# Altium schematic sheet debug.SchDoc
size A4; Organization: Altium Limited; Address1: L3, 12a Rodborough Rd; Address2: Frenchs Forest; Address3: NSW; Address4: Australia 2086
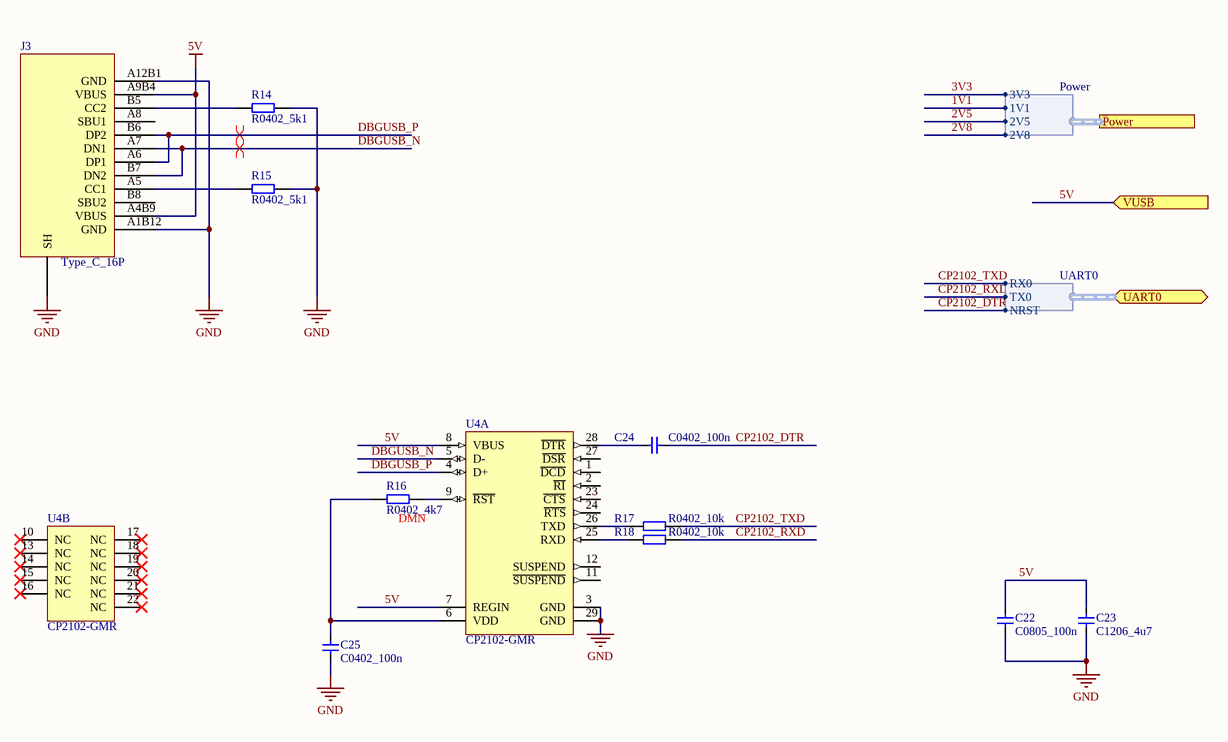
[diagram p0: debug.SchDoc]

## Parts
C22  C0805_100n  [C0805]
C23  C1206_4u7  [C1206]
C24  C0402_100n  [C0402]
C25  C0402_100n  [C0402]
J3  Type_C_16P  [Type_C_16P]
R14  R0402_5k1  [R0402]
R15  R0402_5k1  [R0402]
R16  R0402_4k7  [R0402]
R17  R0402_10k  [R0402]
R18  R0402_10k  [R0402]
U4  CP2102-GMR  [SLAB-QFN-28-3125x3125TP_M]  (parts A,B of 2)

## Ports
Power (harness Power), UART0 (bidir, harness UART0), VUSB (in)

## Harnesses
Power: 3V3, 1V1, 2V5, 2V8
UART0: RX0, TX0, NRST

## Nets
5V: C22.1 C23.1 J3.A4B9(VBUS) J3.A9B4(VBUS) U4.7(REGIN) U4.8(VBUS) ; port VUSB
GND: C22.2 C23.2 C25.2 J3.0(SH) J3.A1B12(GND) J3.A12B1(GND) R14.2 R15.2 U4.3(GND) U4.29(GND)
1V1: port Power.1V1
2V5: port Power.2V5
2V8: port Power.2V8
3V3: port Power.3V3
CP2102_DTR: C24.2 ; port UART0.NRST
CP2102_RXD: R18.2 ; port UART0.TX0
CP2102_TXD: R17.2 ; port UART0.RX0
DBGUSB_N: J3.A7(DN1) J3.B7(DN2) U4.5(D-)
DBGUSB_P: J3.A6(DP1) J3.B6(DP2) U4.4(D+)
NetC24_1: C24.1 U4.28(~{DTR})
NetC25_1: C25.1 R16.1 U4.6(VDD)
NetJ3_A5: J3.A5(CC1) R15.1
NetJ3_B5: J3.B5(CC2) R14.1
NetR16_2: R16.2 U4.9(~{RST})
NetR17_1: R17.1 U4.26(TXD)
NetR18_1: R18.1 U4.25(RXD)

Not connected (* = marked no-connect by the designer): J3 A8(SBU1) B8(SBU2); U4 1(~{DCD}) 2(~{RI}) 10(NC)* 11(~{SUSPEND}) 12(SUSPEND) 13(NC)* 14(NC)* 15(NC)* 16(NC)* 17(NC)* 18(NC)* 19(NC)* 20(NC)* 21(NC)* 22(NC)* 23(~{CTS}) 24(~{RTS}) 27(~{DSR})

## Layout directives
differential pair: DBGUSB_N, DBGUSB_P

## Notes on the sheet
- (near R16) DMN
- Title
- Size:
- Date:
- A4
- Number:
- Time:
- Revision:
- Sheet
- of
- File:

## Library data of the parts
C22 = CMP-003-0073-1: Manufacturer 1: Kemet; Manufacturer Part Number 1: C0805C104K3RAC; Dielectric: X7R; Value: 100n; Tolerance: 0.1%; Voltage Rating DC: 25V; Hidden Value: C104; Component Type: Standard; Part Number: C0805_100n; Pin Count: 2
C23 = CMP-003-0093-1: Manufacturer 1: Kemet; Manufacturer Part Number 1: C1206C475K4RAC; Voltage Rating DC: 16V; Dielectric: X7R; Tolerance: 0.1%; Hidden Value: C475; Value: 4u7; Component Type: Standard; Part Number: C1206_4u7; Pin Count: 2
C24 C25 = CMP-003-0006-1: Manufacturer 1: Kemet; Manufacturer Part Number 1: C0402C104K4RACTU; Dielectric: X7R; Voltage Rating DC: 16V; Value: 100n; Tolerance: 0.1%; Part Number: C0402_100n; Pin Count: 2; Component Type: Standard
R14 R15 = CMP-004-0436-1: Manufacturer 1: Vishay; Manufacturer Part Number 1: CRCW04025K10FKED; Value: 5k1; Tolerance: 1%; Power Rating: 62,5mW; Pin Count: 2; Component Type: Standard; Part Number: R0402_5k1
R16 = CMP-004-0435-1: Manufacturer Part Number 1: CRCW04024K70FKED; Manufacturer 1: Vishay; Tolerance: 1%; Power Rating: 62,5mW; Value: 4k7; Pin Count: 2; Component Type: Standard; Part Number: R0402_4k7
R17 R18 = CMP-004-0443-1: Manufacturer 1: Vishay; Manufacturer Part Number 1: CRCW040210K0FKED; Power Rating: 62,5mW; Value: 10k; Tolerance: 1%; Part Number: R0402_10k; Component Type: Standard; Pin Count: 2
U4 = CMP-2000-04924-1: Single-Chip USB to URAT Bridge, 3.3 V, -40 to 85 degC, 28-Pin QFN, RoHS, Tape and Reel; Manufacturer: Silicon Labs; Interface Circuit Standard 1: RS-232; Transmitter and Receiver FIFO Counter: No; Supply Current: 26mA; Operating Supply Voltage (Min): 3V; Operating Supply Voltage (Typ): 3.3V; Data Rate: 1000kbps; Operating Supply Voltage (Max): 3.6V; Number of Channels: 1; Package URL: http://www.silabs.com/Support%20Documents/TechnicalDocs/C8051T61x.pdf; Operating Temperature (Max): 85C; Datasheet URL: http://www.mouser.com/ds/2/368/CP2102-9-247052.pdf; Operating Temperature Classification: Industrial; Operating Temperature (Min): -40C; Package Description: 28-Pin Quad-Flat No-Leads Package, Body 5 x 5 mm, Pitch 0.5 mm; Manufacturer URL: http://www.silabs.com/; Rad Hardened: No; Package Reference: QFN-28; Pin Count: 28; Packaging: TapeandReel; Mounting: SurfaceMount; Package Type: QFNEP; Datasheet Version: Rev. 1.6, 12/2013